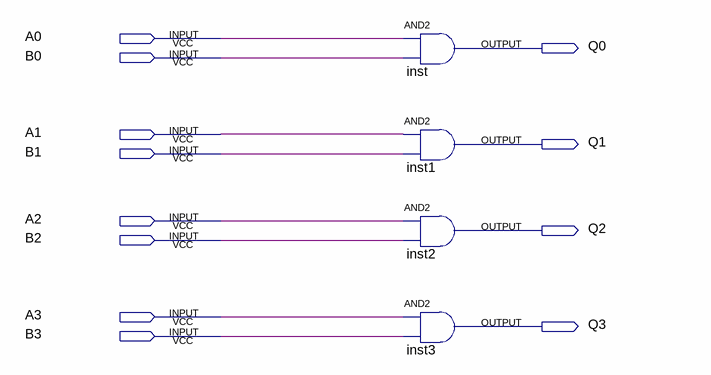
[diagram p0: schematic sheet]
// Quartus schematic and4x4bits.bdf as structural Verilog: 4 symbols, 12 pins
module and4x4bits (
  input  A0,
  input  B0,
  input  A1,
  input  B1,
  input  A2,
  input  B2,
  input  A3,
  input  B3,
  output Q0,
  output Q1,
  output Q2,
  output Q3
);

  and inst (Q0, A0, B0);
  and inst1 (Q1, A1, B1);
  and inst2 (Q2, A2, B2);
  and inst3 (Q3, A3, B3);
endmodule
